# EAGLE design AutoLevel Module V2 (EAGLE 9.3.2)
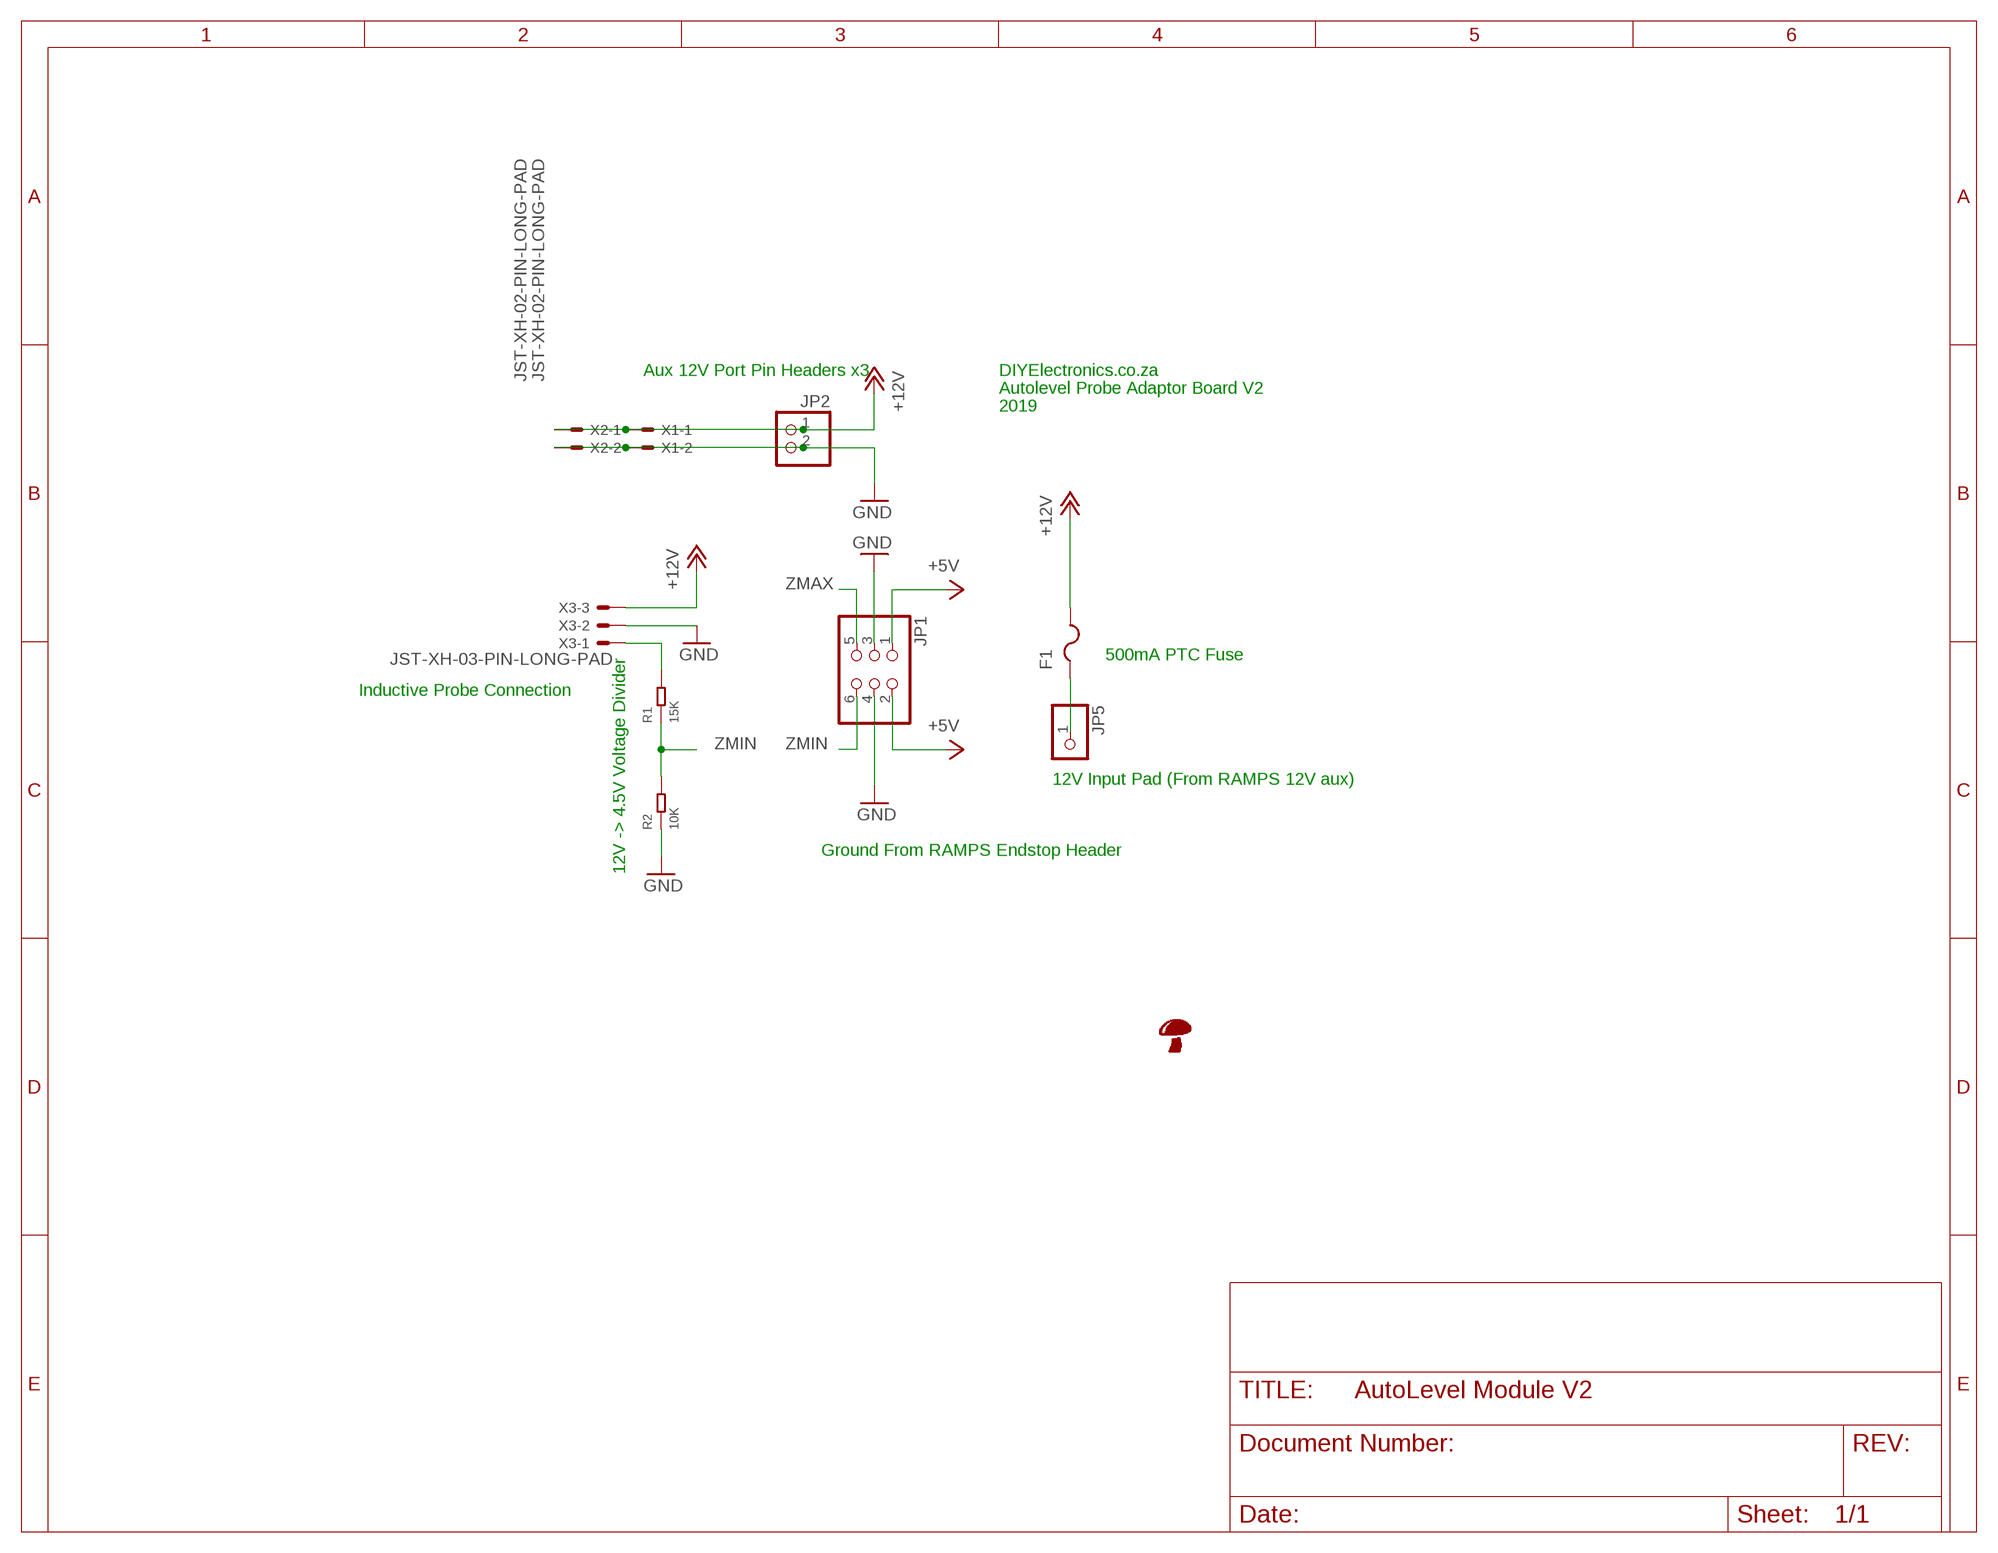
[diagram p0: schematic, sheet 1]

## Parts
F1  PTCFUSE-1812  [1812]
JP1  PINHD-2X3  [2X03]
JP2  PINHD-1X2  [1X02]
JP5  PINHD-1X1  [1X01]
R1  15K  SMD-RES-15K-5%-1/8W(0805)  [R0805]
R2  10K  SMD-RES-10K-1%-1/8W(0805)  [R0805]
U$2  SHROOMBOTTOMSILK  [SHROOM_BS]
X1  JST-XH-02-PIN-LONG-PAD  [JST-XH-02-PACKAGE-LONG-PAD]
X2  JST-XH-02-PIN-LONG-PAD  [JST-XH-02-PACKAGE-LONG-PAD]
X3  JST-XH-03-PIN-LONG-PAD  [JST-XH-03-PACKAGE-LONG-PAD]

## Nets
+5V: JP1.1 JP1.2
+12V: F1.2 JP2.1 X1.1 X2.1 X3.3
GND: JP1.3 JP1.4 JP2.2 R2.1 X1.2 X2.2 X3.2
N$1: F1.1 JP5.1
N$2: R1.2 X3.1
ZMAX: JP1.5
ZMIN: JP1.6 R1.1 R2.2

## Notes on the sheet
- Aux 12V Port Pin Headers x3 | DIYElectronics.co.za
- Autolevel Probe Adaptor Board V2
- 2019
- 500mA PTC Fuse
- Inductive Probe Connection
- 12V Input Pad (From RAMPS 12V aux)
- Ground From RAMPS Endstop Header
- 12V -> 4.5V Voltage Divider

## Library data of the parts
F1 = adafruit:PTCFUSE: PTC fuses, resettable thermistors
JP1 = pinhead:PINHD-2X3: PIN HEADER
JP2 = pinhead:PINHD-1X2: PIN HEADER
JP5 = pinhead:PINHD-1X1: PIN HEADER
R1 = OPL_Resistor:SMD-RES-15K-5%-1/8W(0805): 301012186; MPN: RC0805JR-071KL; VALUE: 1K
R2 = OPL_Resistor:SMD-RES-10K-1%-1/8W(0805): 301012152; MPN: RC0805FR-0710KL
U$2 = RobThePyro:SHROOM
X1 X2 = Rembrandt Electronics - JST XH Connectors v1-0:JST-XH-02-PIN: JST XH Connector 2 Pin Wire to board connector. Pitch: 2,54 mm, (0.100") Number of pins: 2 Created by Rembrandt Electronics www.rembrandtelectronics.com
X3 = Rembrandt Electronics - JST XH Connectors v1-0:JST-XH-03-PIN: JST XH Connector 2 Pin Wire to board connector. Pitch: 2,54 mm, (0.100") Number of pins: 3 Created by Rembrandt Electronics www.rembrandtelectronics.com

## Board
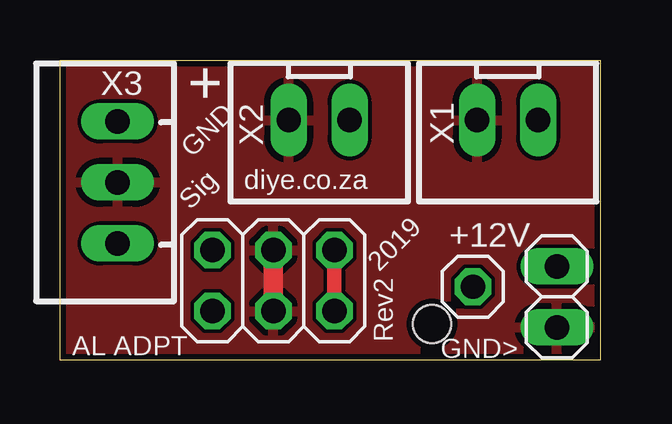
[diagram p1: board, top side]
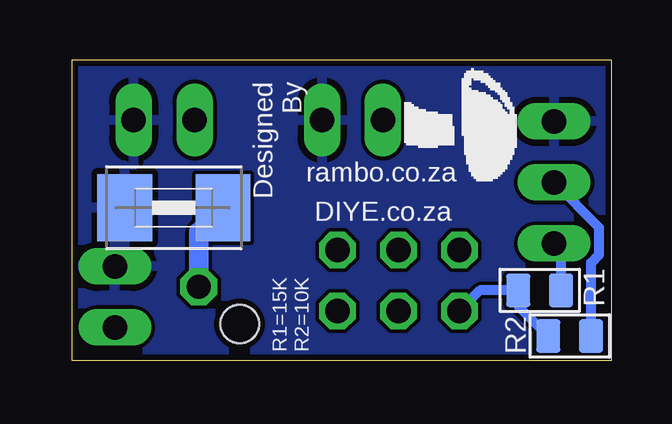
[diagram p2: board, bottom side, seen from below]

Size 22.5 x 12.5 mm. Coordinates in mm from the lower left corner, seen from the top.
Outline: 0,0 0,12.5 22.5,12.5 22.5,0 0,0
Copper layers (1*2*15*16): Top 0.035mm / dielectric 0.2mm / layer 2 0.0175mm / dielectric 1.1mm / layer 15 0.0175mm / dielectric 0.2mm / Bottom 0.035mm
Design rules "SeeedStudio_DRU_no_angle_20130527": minimum track width 6mil, minimum drill 12mil, track to track 6mil, track to pad 6mil, pad to pad 6mil, via to via 6mil, smd to smd 0mil, copper to edge 10mil, drill to drill 10mil, minimum pad ring 6mil, minimum via ring 6mil, stop-mask expansion 2mil, vias tented up to drill 25mil, thermal gap 10mil
Holes 1.6 mm at 15.5,1.5

### Footprints (pad centres in the part's own frame; a part is rotated, then mirrored left to right if it is on the bottom)
1812 = smd 2.286 x 2.794: 1 -2.046,0; 2 2.046,0
2X03 = drill 1.016 octagon: 1 -2.54,-1.27; 2 -2.54,1.27; 3 0,-1.27; 4 0,1.27; 5 2.54,-1.27; 6 2.54,1.27
1X02 = drill 1.016 long: 1 -1.27,0; 2 1.27,0
1X01 = drill 1.016 octagon: 1 0,0
R0805 = smd 1.397 x 1.016: 1 0,0.889; 2 0,-0.889
JST-XH-02-PACKAGE-LONG-PAD = drill 1.016 long: 1 -1.27,0; 2 1.27,0
JST-XH-03-PACKAGE-LONG-PAD = drill 1.016 long: 1 -2.54,0; 2 0,0; 3 2.54,0

### Placement (x,y rotation side)
F1  18.24,6.34 180 bottom
JP1  8.89,3.31 180 top
JP2  20.7,2.63 270 top
JP5  17.2,3.05 0 top
R1  3,2.9 90 bottom
R2  1.75,1 270 bottom
U$2  8.6,12.1 270 bottom
X1  18.65,10 180 top
X2  10.8,10 180 top
X3  2.4,7.4 90 top

### Tracks (layer width: path | path; a pad name or v marks a point on that pad's centre or on a via)
+5V
  Top 0.61: JP1.1 JP1.2
+12V
  pour Bottom: 0,0 0,12.5 22.45,12.5 22.45,0.05 0.05,0.05
GND
  Top 0.813: JP1.3 JP1.4
  Bottom 0.406: R2.1 0.86,4.06 0.52,4.4 0.52,5.52 X3.2
  pour Top: 0,0 0,12.5 22.5,12.5 22.5,0
N$1
  Bottom 0.813: JP5.1 17.2,5.34 F1.1
N$2
  Bottom 0.406: R1.2 2.11,4.57 X3.1
ZMIN
  Bottom 0.406: JP1.6 5.49,2.9 R1.1 3.89,2.25 R2.2

### Text on the board
tNames: + | GND | diye.co.za | Sig | +12V | 2019 | AL ADPT | Rev2 | GND>
bNames: Designed / By | rambo.co.za | DIYE.co.za | R1=15K / R2=10K